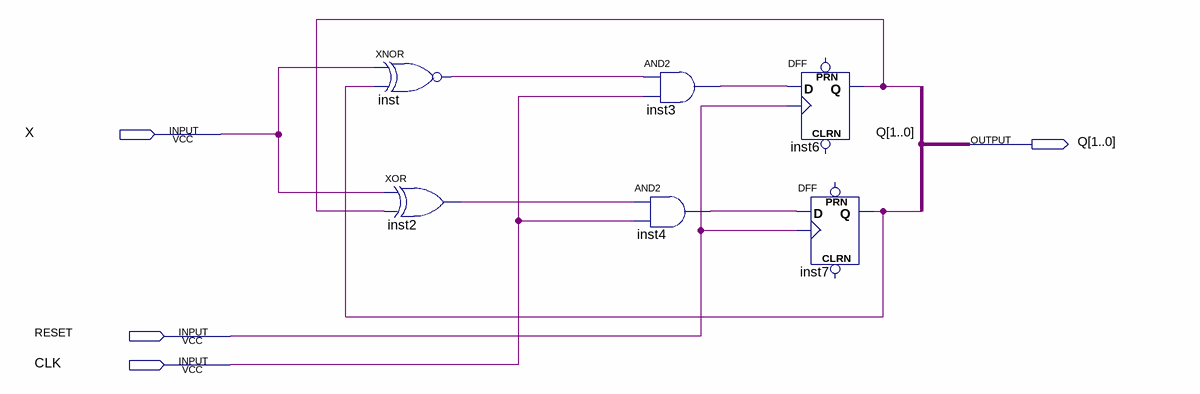
[diagram p0: schematic sheet]
// Quartus schematic MEF.bdf as structural Verilog: 6 symbols, 4 pins
module MEF (
  input  X,
  input  RESET,
  input  CLK,
  output [1:0] Q
);

  wire inst2_out, inst3_out, inst4_out, inst6_q, inst7_q, inst_out;

  xnor inst (inst_out, X, inst7_q);
  xor inst2 (inst2_out, X, inst6_q);
  and inst3 (inst3_out, inst_out, CLK);
  and inst4 (inst4_out, inst2_out, CLK);
  DFF inst6 (.CLK(RESET), .D(inst3_out), .Q(inst6_q));  // open: CLRN, PRN
  DFF inst7 (.CLK(RESET), .D(inst4_out), .Q(inst7_q));  // open: CLRN, PRN
endmodule
